# Altium schematic sheet Cable Organization.SchDoc
size Letter; DocumentNumber: 8; SheetNumber: 8; SheetTotal: 11; Pagesize: Letter
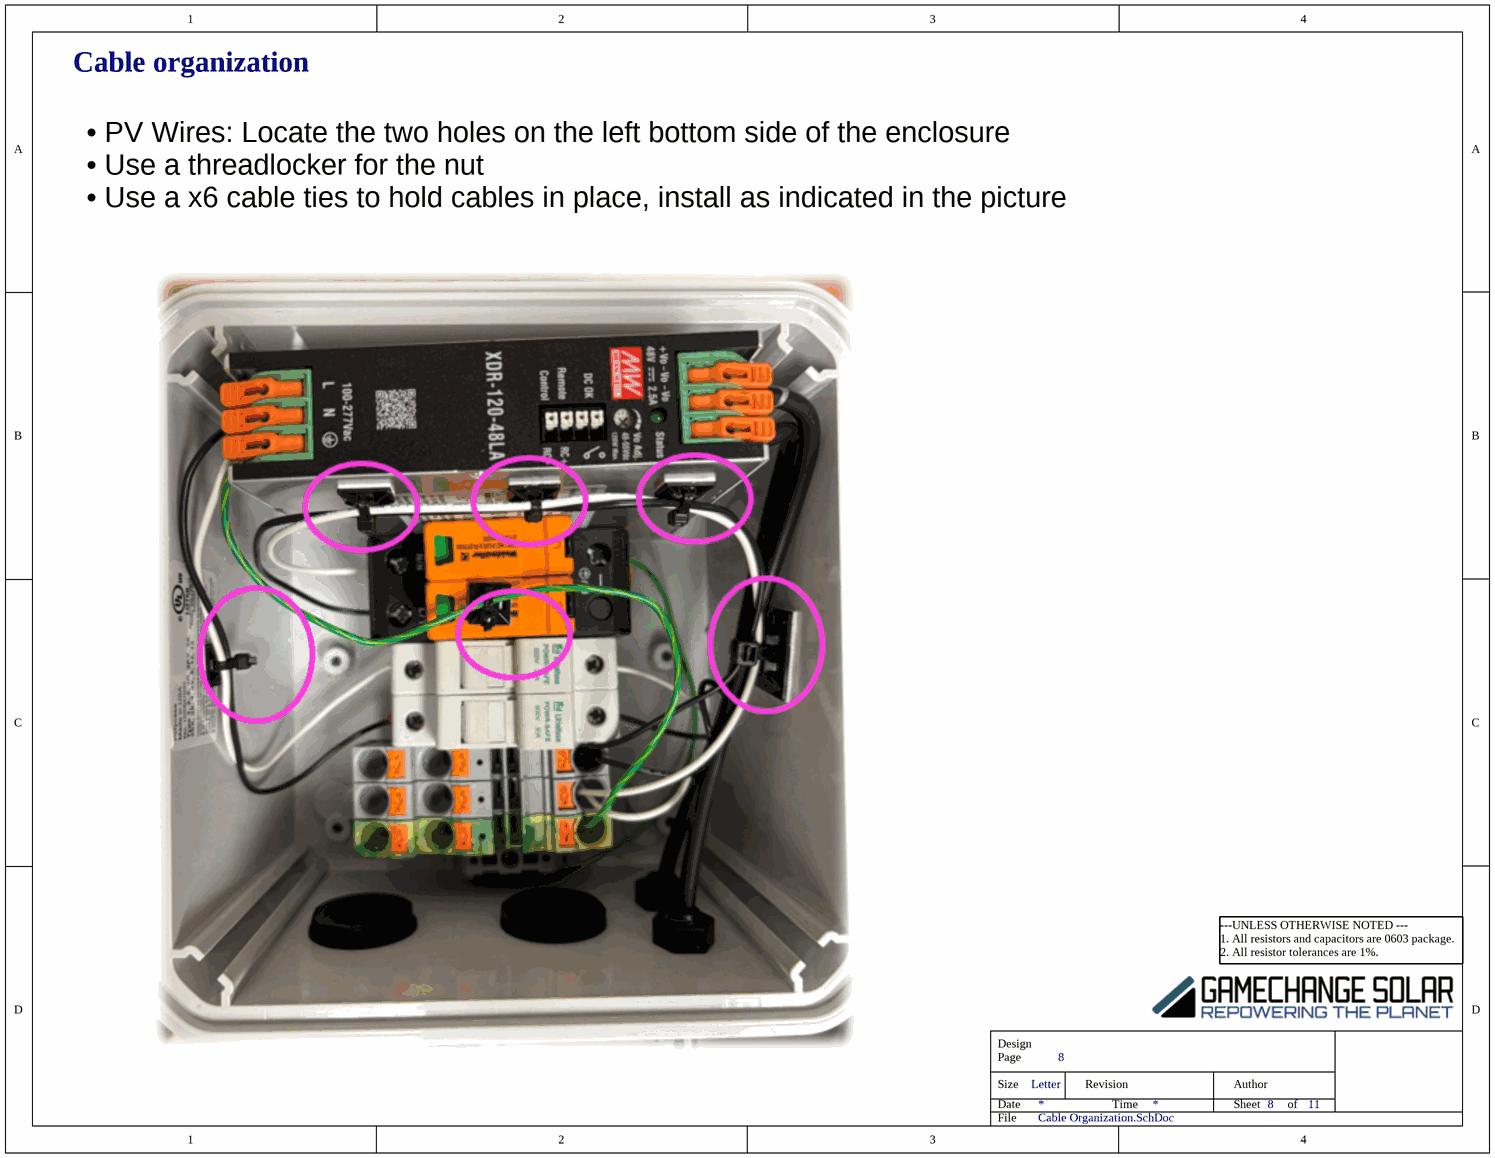
[diagram p0: Cable Organization.SchDoc]

## Notes on the sheet
- Cable organization
- • PV Wires: Locate the two holes on the left bottom side of the enclosure
  • Use a threadlocker for the nut
  • Use a x6 cable ties to hold cables in place, install as indicated in the picture
- ---UNLESS OTHERWISE NOTED ---
  1. All resistors and capacitors are 0603 package.
  2. All resistor tolerances are 1%.
- Design
- Size
- Date
- Page
- Revision
- Time
- Sheet
- Author
- of
- File